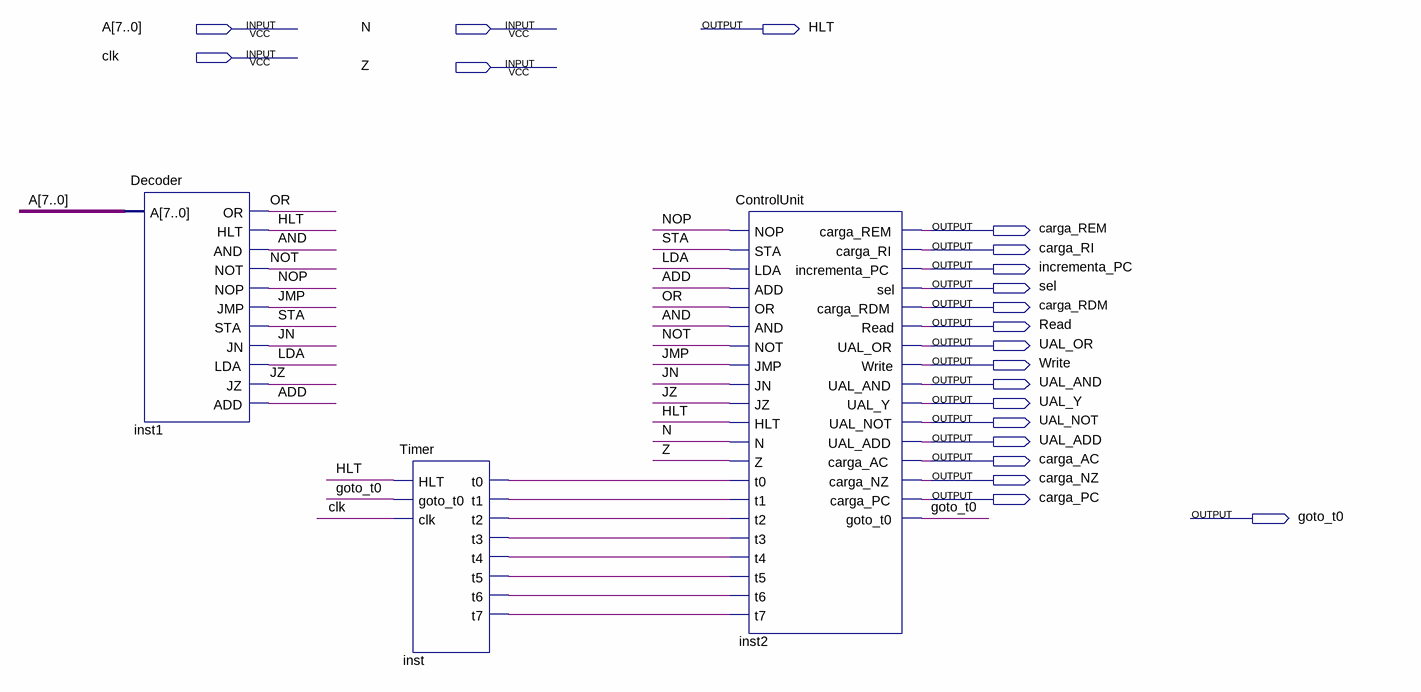
[diagram p0: schematic sheet]
// Quartus schematic LAB09.bdf as structural Verilog: 3 symbols, 21 pins
module LAB09 (
  input  [7:0] A,
  input  N,
  input  clk,
  input  Z,
  output HLT,
  output carga_REM,
  output carga_RI,
  output incrementa_PC,
  output sel,
  output carga_RDM,
  output Read,
  output UAL_OR,
  output Write,
  output UAL_AND,
  output UAL_Y,
  output UAL_NOT,
  output UAL_ADD,
  output carga_AC,
  output carga_NZ,
  output carga_PC,
  output goto_t0
);

  wire ADD, AND, inst_t0, inst_t1, inst_t2, inst_t3, inst_t4, inst_t5, inst_t6, inst_t7, JMP, JN, JZ, LDA,
       NOP, NOT, OR, STA;

  Decoder inst1 (
    .A(A), .OR(OR), .HLT(HLT), .AND(AND), .NOT(NOT), .NOP(NOP), .JMP(JMP), .STA(STA), .JN(JN), .LDA(LDA),
    .JZ(JZ), .ADD(ADD));
  Timer inst (
    .HLT(HLT), .goto_t0(goto_t0), .clk(clk), .t0(inst_t0), .t1(inst_t1), .t2(inst_t2), .t3(inst_t3),
    .t4(inst_t4), .t5(inst_t5), .t6(inst_t6), .t7(inst_t7));
  ControlUnit inst2 (
    .NOP(NOP), .STA(STA), .LDA(LDA), .ADD(ADD), .OR(OR), .AND(AND), .NOT(NOT), .JMP(JMP), .JN(JN), .JZ(JZ),
    .HLT(HLT), .N(N), .Z(Z), .t0(inst_t0), .t1(inst_t1), .t2(inst_t2), .t3(inst_t3), .t4(inst_t4),
    .t5(inst_t5), .t6(inst_t6), .t7(inst_t7), .carga_REM(carga_REM), .carga_RI(carga_RI),
    .incrementa_PC(incrementa_PC), .sel(sel), .carga_RDM(carga_RDM), .Read(Read), .UAL_OR(UAL_OR),
    .Write(Write), .UAL_AND(UAL_AND), .UAL_Y(UAL_Y), .UAL_NOT(UAL_NOT), .UAL_ADD(UAL_ADD),
    .carga_AC(carga_AC), .carga_NZ(carga_NZ), .carga_PC(carga_PC), .goto_t0(goto_t0));
endmodule
